# Altium schematic sheet [1]Power.SchDoc
size A4
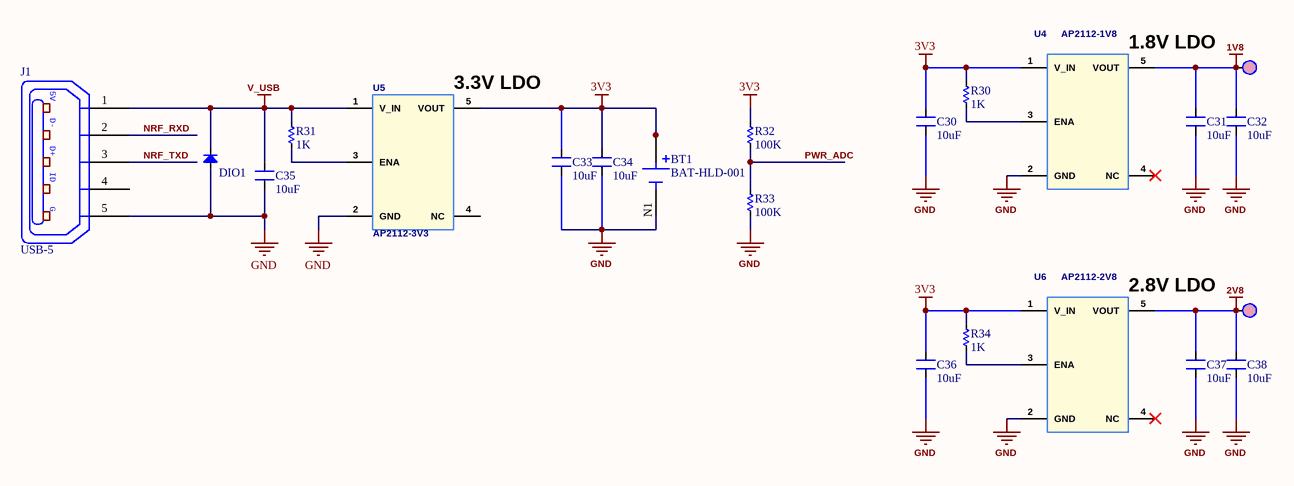
[diagram p0: [1]Power.SchDoc]

## Parts
BT1  BAT-HLD-001  [BAT_BAT-HLD-001]
C30  10uF  [CN-SMD-0603]
C31  10uF  [CN-SMD-0603]
C32  10uF  [CN-SMD-0603]
C33  10uF  [CN-SMD-0603]
C34  10uF  [CN-SMD-0603]
C35  10uF  [CN-SMD-0603]
C36  10uF  [CN-SMD-0603]
C37  10uF  [CN-SMD-0603]
C38  10uF  [CN-SMD-0603]
DIO1  Diode SMD  [DIO-SMD-123]  (value not drawn)
J1  USB-5  [USB-M1]
R30  1K  [RES-SMD-0603]
R31  1K  [RES-SMD-0603]
R32  100K  [RES-SMD-0603]
R33  100K  [RES-SMD-0603]
R34  1K  [RES-SMD-0603]
TP6  TP  [P-TP 1MM]  (value not drawn)  (no BOM)
TP7  TP  [P-TP 1MM]  (value not drawn)  (no BOM)
U4  AP2112-1V8  [SOT235_AP2112]
U5  AP2112-3V3  [SOT235_AP2112]
U6  AP2112-2V8  [SOT235_AP2112]

## Nets
1V8: C31.2 C32.2 TP6.1 U4.5(VOUT)
2V8: C37.2 C38.2 TP7.1 U6.5(VOUT)
3V3: BT1.P1(POS) BT1.P2(POS) C30.2 C33.2 C34.2 C36.2 R30.1 R32.1 R34.1 U4.1(V_IN) U5.5(VOUT) U6.1(V_IN)
GND: BT1.N1(NEG) C30.1 C31.1 C32.1 C33.1 C34.1 C35.1 C36.1 C37.1 C38.1 DIO1.1(A) J1.5(P5) R33.2 U4.2(GND) U5.2(GND) U6.2(GND)
V_USB: C35.2 DIO1.2(K) J1.1(P1) R31.1 U5.1(V_IN)
NRF_RXD: J1.2(P2)
NRF_TXD: J1.3(P3)
PWR_ADC: R32.2 R33.1
NetR30_2: R30.2 U4.3(ENA)
NetR31_2: R31.2 U5.3(ENA)
NetR34_2: R34.2 U6.3(ENA)

Not connected (* = marked no-connect by the designer): J1 4(P4); U4 4(NC)*; U5 4(NC); U6 4(NC)*

## Notes on the sheet
- (near U4) 1.8V LDO
- (near U5) 3.3V LDO
- (near U6) 2.8V LDO
- (in symbol USB-5) 5V; D-; D+; ID; G

## Library data of the parts
BT1 = BAT-HLD-001: Holder for CR2032 and CR2025 Batteries, Surface-Mount, Bulk Packaging; MF: Linx Technologies; SnapEDA_Link: https://www.snapeda.com/parts/BAT-HLD-001/Linx%20Technologies%20Inc./view-part/184402/?ref=snap; Availability: In Stock; Value: *; Check_prices: https://www.snapeda.com/parts/BAT-HLD-001/Linx%20Technologies%20Inc./view-part/184402/?ref=eda; Package: None; Price: None; MP: BAT-HLD-001
C30-C38 = CN: Tu gom; Value: 33pF
DIO1 = Diode SMD: Default Diode; Code - JEDEC: DO-214-AB; Value: 1N5007; Published: 8-Jun-2000; Revision: July-2002: Re-released for DXP Platform.; Publisher: Altium Limited
J1 = USB-5: Manufacturer: FCI; Manufacturer Part Number: 10118193-0001LF; Connector Type: USB - micro B; Number of Contacts: 5; Gender: Receptacle; Specifications: USB 2.0; .Creator: MM; .Checked PCB: RF; Supplier 1: Digi-Key; RoHS: RoHS Compliant; Category: Connectors, Interconnects; Stock 1: 28642; Pricing 1: 1=0.46, 10=0.433, 25=0.3712, 50=0.3156, 100=0.3032, 250=0.27224, 500=0.25988 (USD); Packaging: Cut Tape (CT); Mounting Type: Surface Mount, Right Angle, Horizontal; Features: Shielded, Solder Retention; Ingress Protection: -; ComponentLink1URL: http://portal.fciconnect.com/Comergent//fci/drawing/10118193.pdf; ComponentLink1Description: http://portal.fciconnect.com/Comergent//fci/drawing/10118193.pdf; Supplier Part Number 1: 609-4616-1-ND; .Checked SCH: MM
R30-R34 = Res-SMD: Resistor; Manufacturer: Generic Components; Class: Passive; Published: 08/06/2000; Publisher: Altium Hobart Technology Centre
TP6 TP7 = P-TESTPOINT
U4 U6 = AP2112-1V8: 600mA CMOS LDO REGULATOR WITH ENABLE
U5 = AP2112-3V3: 600mA CMOS LDO REGULATOR WITH ENABLE